# EAGLE schematic placa_v4 (EAGLE 6.2)
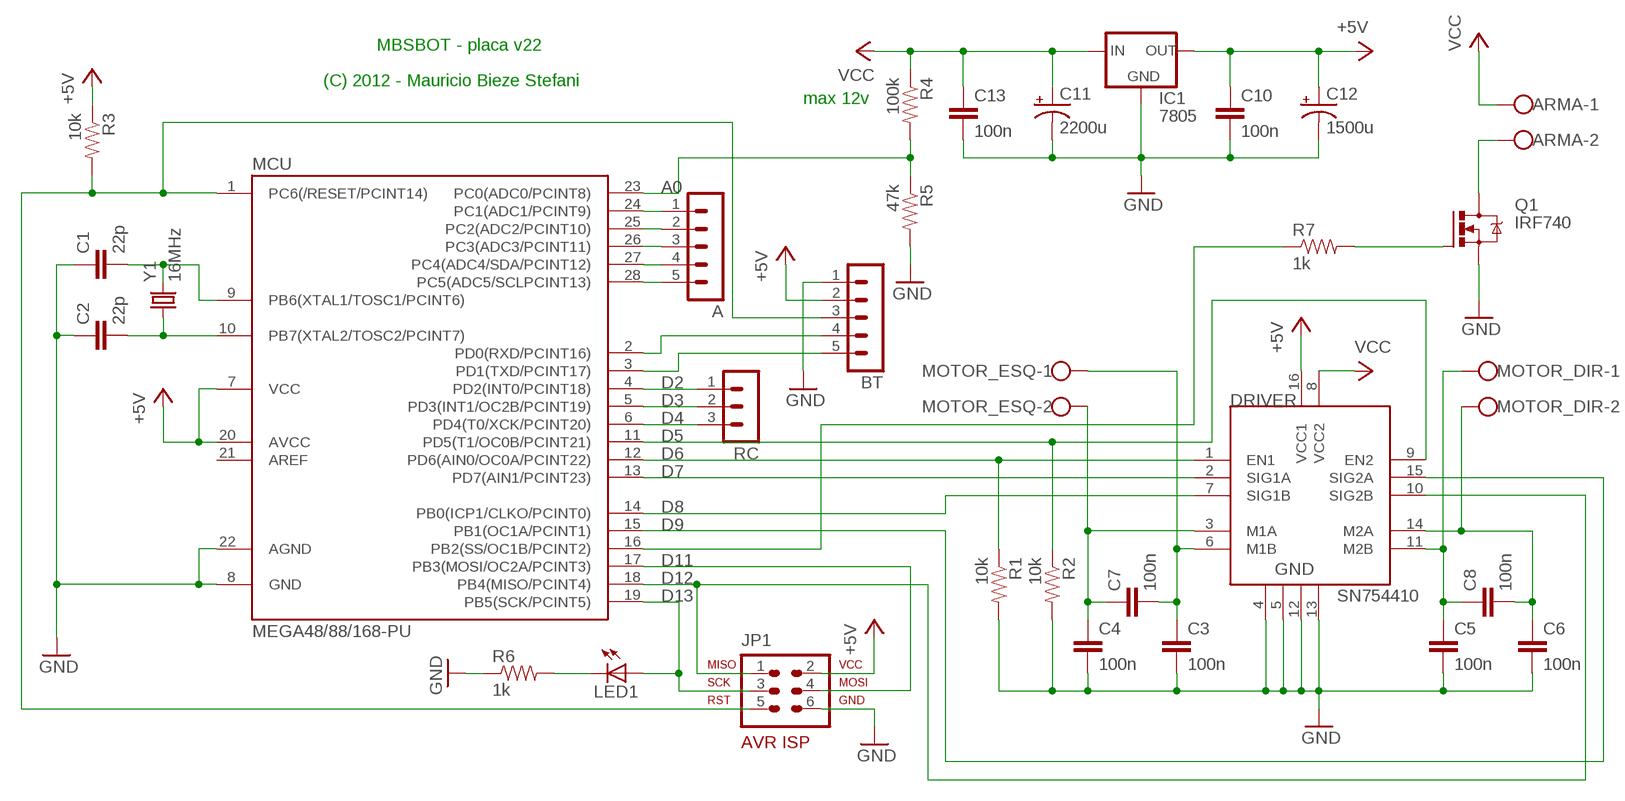
[diagram p0: schematic, sheet 1]

## Parts
A  MA05-1  [MA05-1]
ARMA  W237-102  [W237-102]
BT  MA05-1  [MA05-1]
C1  22p  CAPKIT  [CAP-PTH-SMALL-KIT]
C2  22p  CAPKIT  [CAP-PTH-SMALL-KIT]
C3  100n  CAPPTH1  [CAP-PTH-5MM]
C4  100n  CAPPTH1  [CAP-PTH-5MM]
C5  100n  CAPPTH1  [CAP-PTH-5MM]
C6  100n  CAPPTH1  [CAP-PTH-5MM]
C7  100n  CAPPTH1  [CAP-PTH-5MM]
C8  100n  CAPPTH1  [CAP-PTH-5MM]
C10  100n  CAPPTH1  [CAP-PTH-5MM]
C11  2200u  CAP_POLPTH1  [CPOL-RADIAL-100UF-25V]
C12  1500u  CAP_POLPTH1  [CPOL-RADIAL-100UF-25V]
C13  100n  CAPPTH1  [CAP-PTH-5MM]
DRIVER  SN754410  [DIP16]
IC1  7805  78XXS  [78XXS]
JP1  AVR-ISP-6VERT  [AVR-ISP-6]
LED1  LED3MM  [LED3MM]
MCU  MEGA48/88/168-PU  [DIL28-3]
MOTOR_DIR  W237-102  [W237-102]
MOTOR_ESQ  W237-102  [W237-102]
Q1  IRF740  [TO220BV]
R1  10k  RESISTORPTH-1/2W  [AXIAL-0.5]
R2  10k  RESISTORPTH-1/2W  [AXIAL-0.5]
R3  10k  RESISTORPTH-1/2W  [AXIAL-0.5]
R4  100k  RESISTORPTH-1/2W  [AXIAL-0.5]
R5  47k  RESISTORPTH-1/2W  [AXIAL-0.5]
R6  1k  RESISTORKIT  [AXIAL-0.3-KIT]
R7  1k  RESISTORKIT  [AXIAL-0.3-KIT]
RC  MA03-1  [MA03-1]
Y1  16MHz  CRYSTALHC49US  [HC49US]

## Nets
+5V: BT.2 C10.1 C12.1(+) DRIVER.16(VCC1) IC1.OUT JP1.2 MCU.7(VCC) MCU.20(AVCC) R3.P$1
A: BT.4 MCU.2(PD0(RXD/PCINT16))
A0: MCU.23(PC0(ADC0/PCINT8)) R4.P$2 R5.P$1
D2: MCU.4(PD2(INT0/PCINT18)) RC.1
D3: MCU.5(PD3(INT1/OC2B/PCINT19)) RC.2
D4: MCU.6(PD4(T0/XCK/PCINT20)) RC.3
D5: DRIVER.9(EN2) MCU.11(PD5(T1/OC0B/PCINT21)) R2.P$1
D6: DRIVER.1(EN1) MCU.12(PD6(AIN0/OC0A/PCINT22)) R1.P$1
D7: DRIVER.2(SIG1A) MCU.13(PD7(AIN1/PCINT23))
D8: DRIVER.7(SIG1B) MCU.14(PB0(ICP1/CLKO/PCINT0))
D9: DRIVER.15(SIG2A) MCU.15(PB1(OC1A/PCINT1)) MCU.16(PB2(SS/OC1B/PCINT2)) R7.P$1
D11: JP1.4 MCU.17(PB3(MOSI/OC2A/PCINT3))
D12: DRIVER.10(SIG2B) JP1.1 MCU.18(PB4(MISO/PCINT4))
D13: JP1.3 LED1.A MCU.19(PB5(SCK/PCINT5))
GND: BT.1 C1.1 C2.1 C3.2 C4.2 C5.2 C6.2 C10.2 C11.2(-) C12.2(-) C13.2 DRIVER.4 DRIVER.5 DRIVER.12 DRIVER.13 IC1.GND JP1.6 MCU.8(GND) MCU.22(AGND) Q1.S R1.P$2 R2.P$2 R5.P$2 R6.P$1
N$1: LED1.K(C) R6.P$2
N$2: Q1.G R7.P$2
N$3: C1.2 MCU.9(PB6(XTAL1/TOSC1/PCINT6)) Y1.2
N$4: C2.2 MCU.10(PB7(XTAL2/TOSC2/PCINT7)) Y1.1
N$5: C4.1 C7.1 DRIVER.3(M1A) MOTOR_ESQ.2
N$6: C3.1 C7.2 DRIVER.6(M1B) MOTOR_ESQ.1
N$7: C5.1 C8.1 DRIVER.11(M2B) MOTOR_DIR.1
N$8: C6.1 C8.2 DRIVER.14(M2A) MOTOR_DIR.2
N$9: BT.5 MCU.3(PD1(TXD/PCINT17))
N$10: BT.3 JP1.5 MCU.1(PC6(/RESET/PCINT14)) R3.P$2
N$11: ARMA.2 Q1.D
N$12: A.1 MCU.24(PC1(ADC1/PCINT9))
N$13: A.2 MCU.25(PC2(ADC2/PCINT10))
N$14: A.3 MCU.26(PC3(ADC3/PCINT11))
N$15: A.4 MCU.27(PC4(ADC4/SDA/PCINT12))
N$16: A.5 MCU.28(PC5(ADC5/SCLPCINT13))
VCC: ARMA.1 C11.1(+) C13.1 DRIVER.8(VCC2) IC1.IN R4.P$1
Unconnected: MCU.21(AREF)

## Notes on the sheet
- MBSBOT - placa v22
- (C) 2012 - Mauricio Bieze Stefani
- max 12v

## Library data of the parts
A BT = con-lstb:MA05-1: PIN HEADER; OC_FARNELL: unknown; OC_NEWARK: unknown
ARMA MOTOR_DIR MOTOR_ESQ = con-wago-500:W237-102: WAGO SCREW CLAMP; MPN: 237-102; OC_FARNELL: unknown; OC_NEWARK: 70K9898
C1-C8 C10 C13 = SparkFun:CAP: Capacitor Standard 0603 ceramic capacitor, and 0.1" leaded capacitor.
C11 C12 = SparkFun:CAP_POL: Capacitor Polarized These are standard SMD and PTH capacitors. Normally 10uF, 47uF, and 100uF in electrolytic and tantalum varieties. Always verify the external diameter of the through hole cap, it varies with capacity, voltage, and manufacturer. The EIA devices should be standard.
DRIVER = HBridge:SN754410: Quadruple half-H driver
IC1 = v-reg:78XXS: VOLTAGE REGULATOR
JP1 = avr-7:AVR-ISP-6: AVR ISP-6 Serial Programming Header
LED1 = SparkFun:LED: LEDs Standard schematic elements and footprints for 5mm, 3mm, 1206, and 0603 sized LEDs. 5mm - Spark Fun Electronics SKU : COM-00529 (and others)
MCU = avr-7:MEGA48/88/168-PU
Q1 = transistor-power:IRF740: N-CHANNEL MOS FET
R1-R7 = SparkFun:RESISTOR: Resistor Basic schematic elements and footprints for 0603, 1206, and PTH resistors.
RC = con-lstb:MA03-1: PIN HEADER; OC_FARNELL: unknown; OC_NEWARK: unknown
Y1 = SparkFun:CRYSTAL: Crystals Various standard crystals. Proven footprints. Spark Fun Electronics SKU : COM-00534